# EAGLE design VFD-IV-26-T3-5x7 (EAGLE 7.2.0)
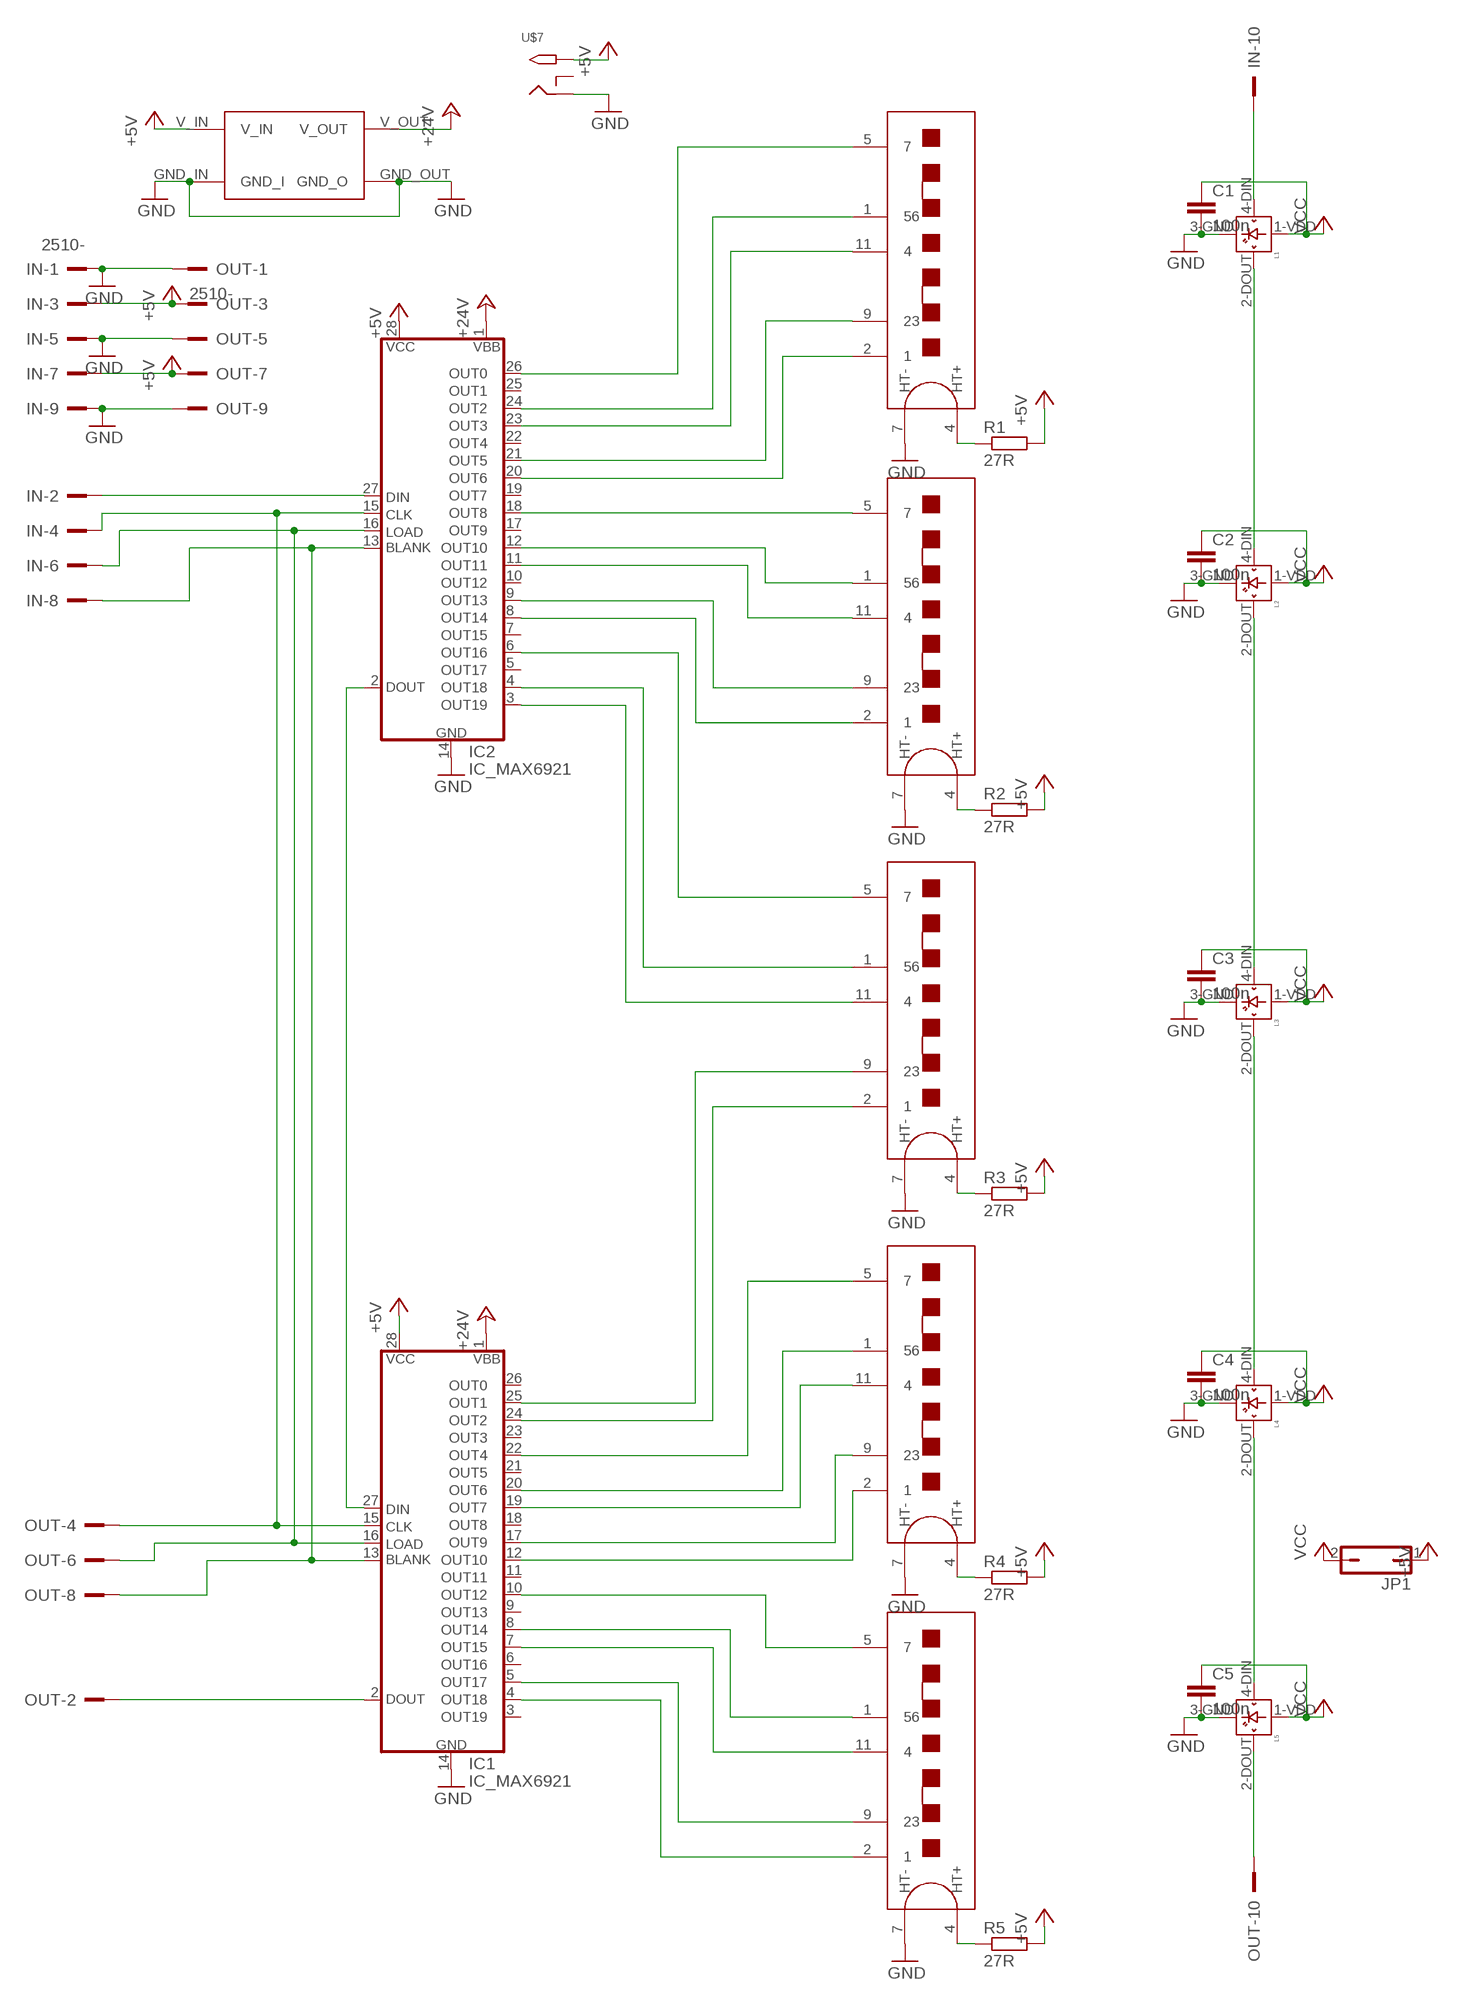
[diagram p0: schematic, sheet 1]

## Parts
1  IV-26-T3_DISP  [IV-26_T2_T3]
2  IV-26-T3_DISP  [IV-26_T2_T3]
3  IV-26-T3_DISP  [IV-26_T2_T3]
4  IV-26-T3_DISP  [IV-26_T2_T3]
5  IV-26-T3_DISP  [IV-26_T2_T3]
C1  100n  C-EU050-025X075  [C050-025X075]
C2  100n  C-EU050-025X075  [C050-025X075]
C3  100n  C-EU050-025X075  [C050-025X075]
C4  100n  C-EU050-025X075  [C050-025X075]
C5  100n  C-EU050-025X075  [C050-025X075]
IC1  IC_MAX6921  [S28]
IC2  IC_MAX6921  [S28]
IN  2510-  [PAK100/2500-10]
JP1  JP1Q  [JP1]
L1  WS2812B  [WS2812B]
L2  WS2812B  [WS2812B]
L3  WS2812B  [WS2812B]
L4  WS2812B  [WS2812B]
L5  WS2812B  [WS2812B]
OUT  2510-  [PAK100/2500-10]
R1  27R  R-EU_0207/10  [0207/10]
R2  27R  R-EU_0207/10  [0207/10]
R3  27R  R-EU_0207/10  [0207/10]
R4  27R  R-EU_0207/10  [0207/10]
R5  27R  R-EU_0207/10  [0207/10]
U$6  STEP_UP_MODULE  [STEP_UP_MODULE]
U$7  2.1MMJACKTHM  [PJ-102A]

## Nets
+5V [power]: IC1.28(VCC) IC2.28(VCC) IN.3 IN.7 JP1.1 OUT.3 OUT.7 R1.2 R2.2 R3.2 R4.2 R5.2 U$6.V_IN U$7.TIP
+24V [lo_power]: IC1.1(VBB) IC2.1(VBB) U$6.V_OUT
GND [power]: 1.7(HT-) 2.7(HT-) 3.7(HT-) 4.7(HT-) 5.7(HT-) C1.2 C2.2 C3.2 C4.2 C5.2 IC1.14(GND) IC2.14(GND) IN.1 IN.5 IN.9 L1.3-GND(GND) L2.3-GND(GND) L3.3-GND(GND) L4.3-GND(GND) L5.3-GND(GND) OUT.1 OUT.5 OUT.9 U$6.GND_IN(GND_I) U$6.GND_OUT(GND_O) U$7.RING
N$1: 1.5 IC2.26(OUT0)
N$3: 1.1 IC2.24(OUT2)
N$4: 1.11 IC2.23(OUT3)
N$6: 1.9 IC2.21(OUT5)
N$7: 1.2 IC2.20(OUT6)
N$8: 2.5 IC2.18(OUT8)
N$10: 2.1 IC2.12(OUT10)
N$11: 2.11 IC2.11(OUT11)
N$13: 2.9 IC2.9(OUT13)
N$14: 2.2 IC2.8(OUT14)
N$15: 3.5 IC2.6(OUT16)
N$17: 3.1 IC2.4(OUT18)
N$18: 3.11 IC2.3(OUT19)
N$20: 3.9 IC1.25(OUT1)
N$21: 3.2 IC1.24(OUT2)
N$22: 4.5 IC1.22(OUT4)
N$24: 4.1 IC1.20(OUT6)
N$25: 4.11 IC1.19(OUT7)
N$27: 4.9 IC1.17(OUT9)
N$28: 4.2 IC1.12(OUT10)
N$29: 5.5 IC1.10(OUT12)
N$31: 5.1 IC1.8(OUT14)
N$32: 5.11 IC1.7(OUT15)
N$34: 5.9 IC1.5(OUT17)
N$35: 5.2 IC1.4(OUT18)
N$36: L1.2-DOUT(DOUT) L2.4-DIN(DIN)
N$37: L2.2-DOUT(DOUT) L3.4-DIN(DIN)
N$38: L3.2-DOUT(DOUT) L4.4-DIN(DIN)
N$39: L4.2-DOUT(DOUT) L5.4-DIN(DIN)
N$40: IC1.15(CLK) IC2.15(CLK) IN.4 OUT.4
N$41: IC1.27(DIN) IC2.2(DOUT)
N$42: IC1.13(BLANK) IC2.13(BLANK) IN.8 OUT.8
N$43: IC1.16(LOAD) IC2.16(LOAD) IN.6 OUT.6
N$44: IC2.27(DIN) IN.2
N$45: IN.10 L1.4-DIN(DIN)
N$47 [lo_power]: 2.4(HT+) R2.1
N$48 [lo_power]: 3.4(HT+) R3.1
N$49 [lo_power]: 4.4(HT+) R4.1
N$50 [lo_power]: 5.4(HT+) R5.1
N$51 [lo_power]: 1.4(HT+) R1.1
N$53: IC1.2(DOUT) OUT.2
N$56: L5.2-DOUT(DOUT) OUT.10
VCC [lo_power]: C1.1 C2.1 C3.1 C4.1 C5.1 JP1.2 L1.1-VDD(VDD) L2.1-VDD(VDD) L3.1-VDD(VDD) L4.1-VDD(VDD) L5.1-VDD(VDD)
Unconnected: IC1.3(OUT19) IC1.6(OUT16) IC1.9(OUT13) IC1.11(OUT11) IC1.18(OUT8) IC1.21(OUT5) IC1.23(OUT3) IC1.26(OUT0) IC2.5(OUT17) IC2.7(OUT15) IC2.10(OUT12) IC2.17(OUT9) IC2.19(OUT7) IC2.22(OUT4) IC2.25(OUT1) U$7.RING_SW

## Library data of the parts
1-5 = vfd:IV-26-T3_DISP
C1-C5 = resistor:C-EU: CAPACITOR, European symbol
IC1 IC2 = rob:IC_MAX6921: 20-outputs, 76V, serial VFD driver Dangerousprototypes.com
IN OUT = con-3m:2510-: 3M (TM) Pak 100 4-Wall Header Source: 3M; MF: 3M; MPN: 2510-6002UB; OC_FARNELL: 9838244; OC_NEWARK: 46F4725
JP1 = jumper:JP1Q: JUMPER
L1-L5 = adafruit:WS2812B
R1-R5 = resistor:R-EU_: RESISTOR, European symbol
U$6 = vfd:STEP_UP_MODULE
U$7 = adafruit:2.1MMJACK: 2.1mm x 5.5mm THM DC jack with internal switch. Digikey part #PJ-102A, 4UCON part #05537 2.1mm x 5.5mm SMT DC jack with internal switch. Digikey part #PJ-002A-SMT, 4UCON part #03267 By microbuilder.eu & adafruit.com

## Net classes
1 lo_power: width 0.5 mm
2 power: width 1 mm

## Board
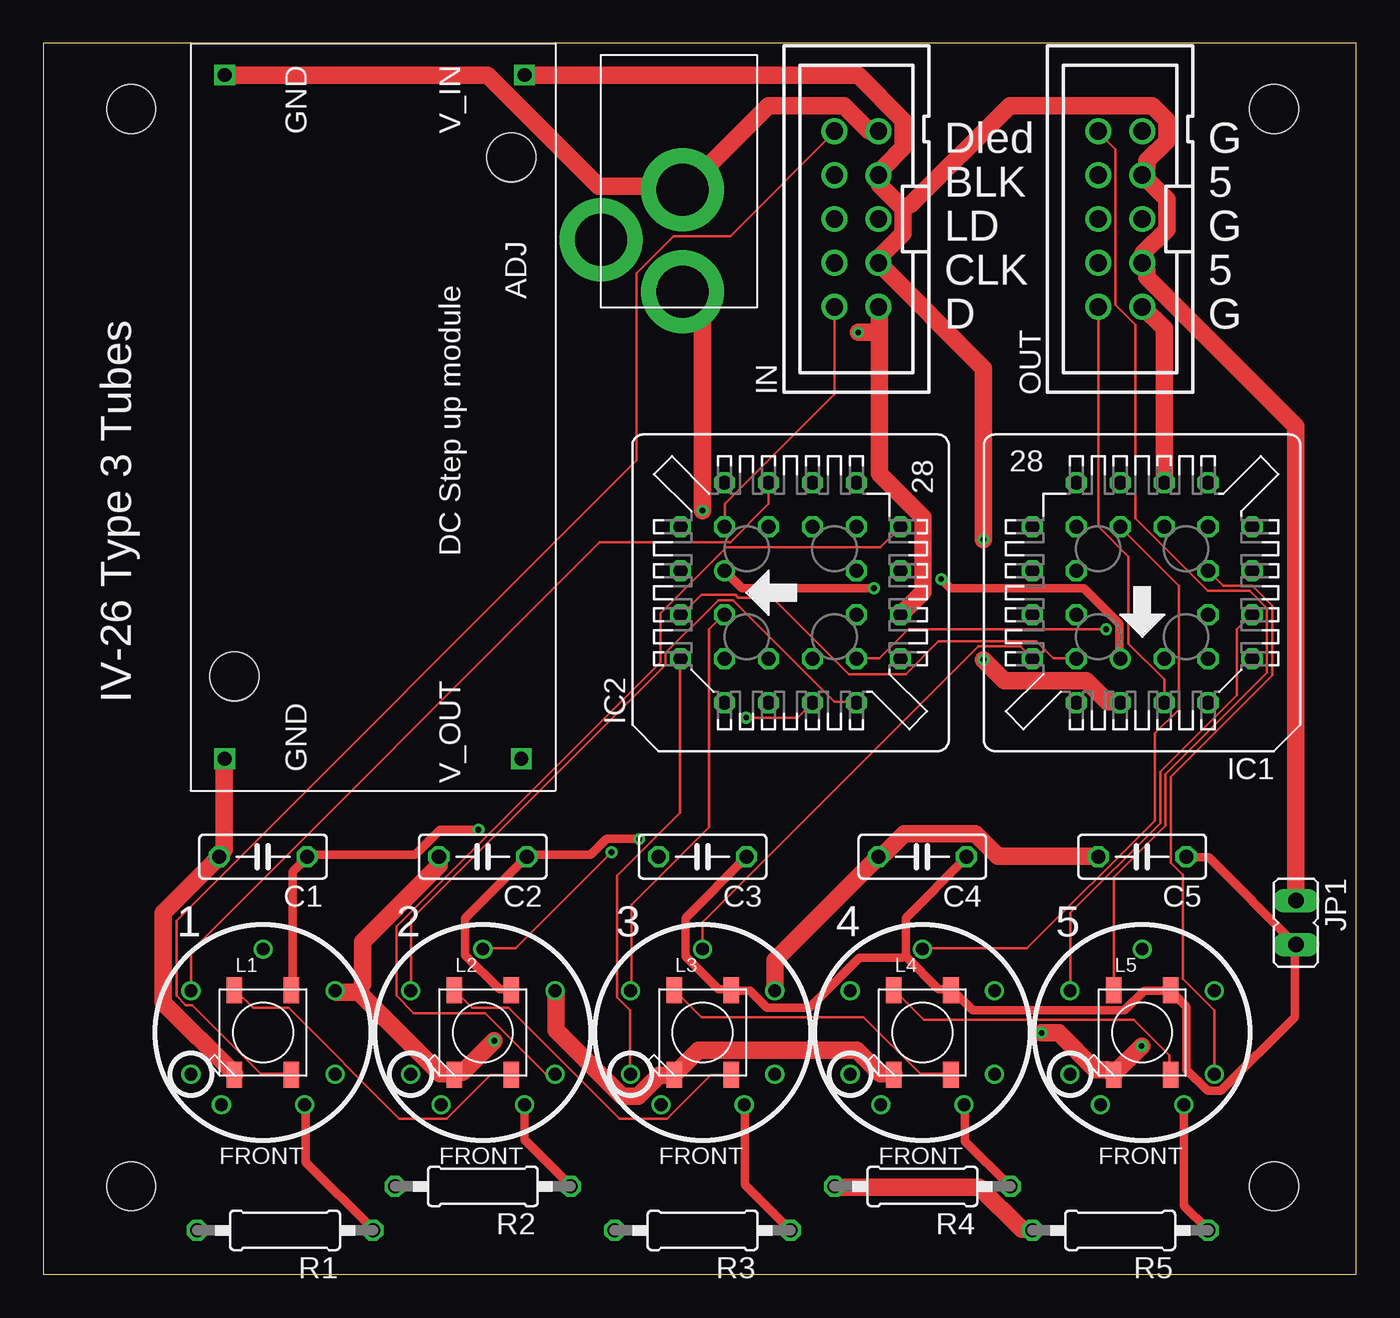
[diagram p1: board, top side]
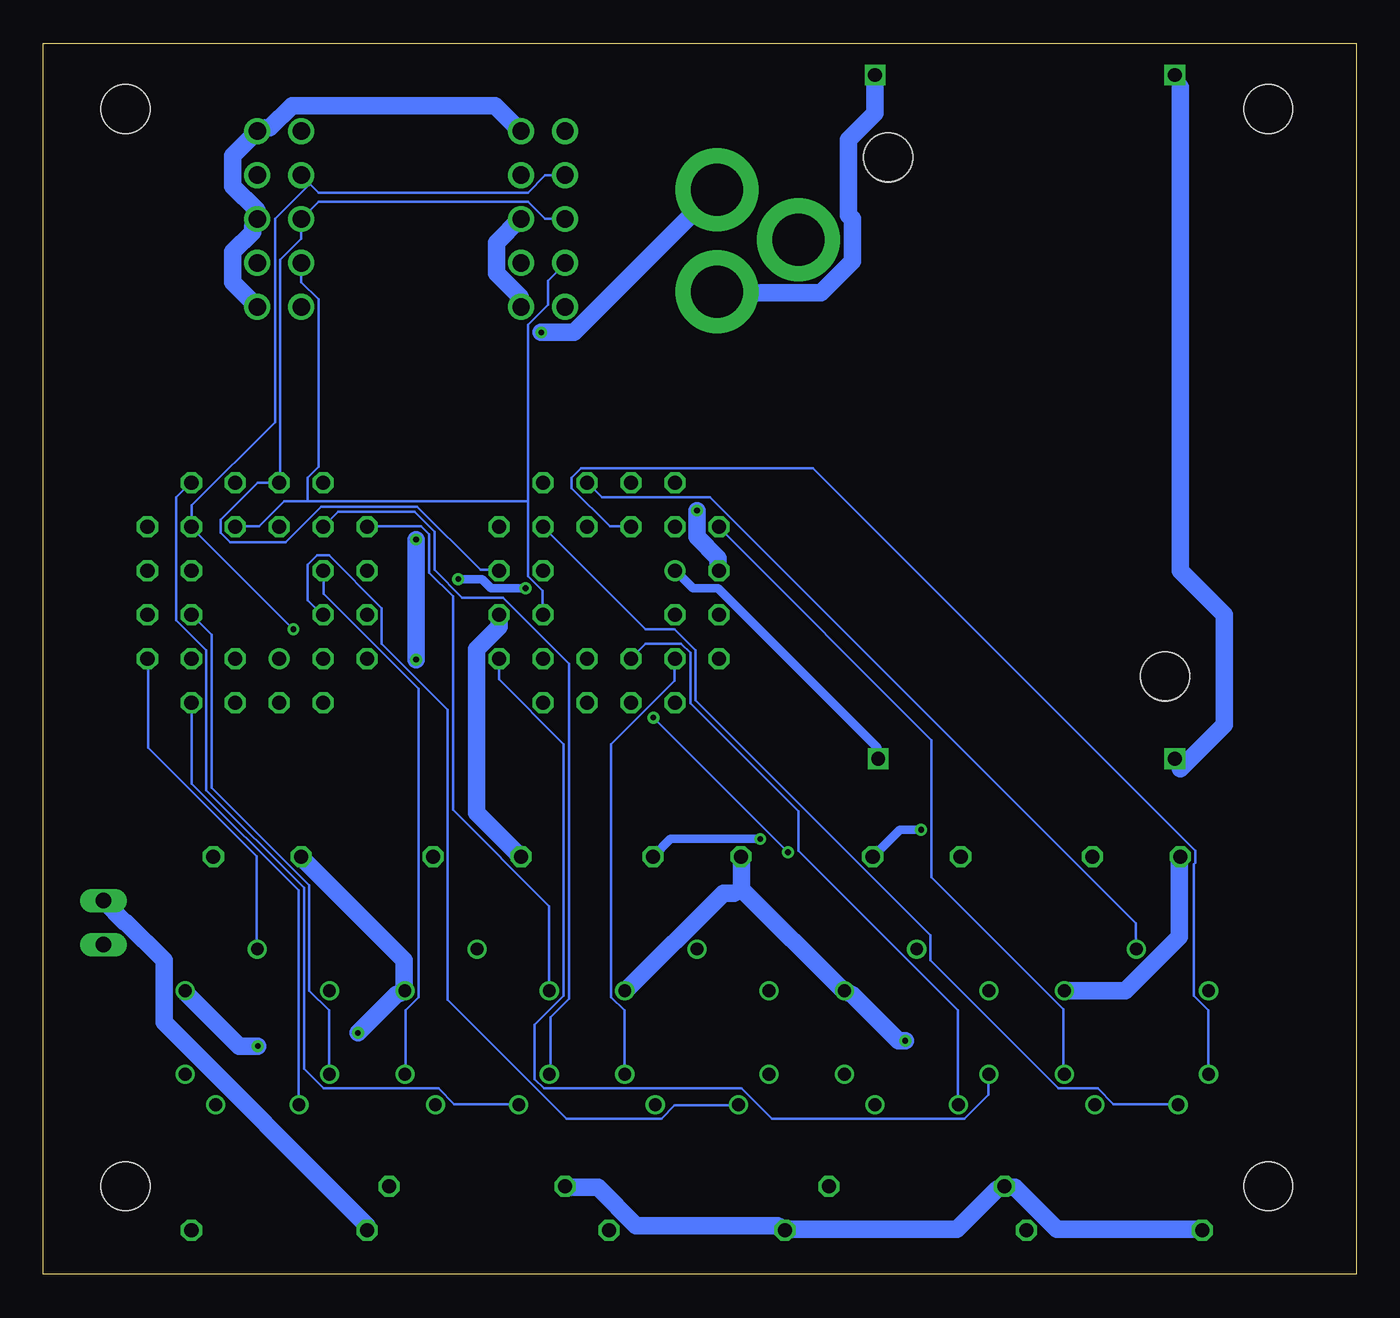
[diagram p2: board, bottom side, seen from below]

Size 75.87 x 71.11 mm. Coordinates in mm from the lower left corner, seen from the top.
Outline: 0,0 75.87,0 75.87,71.11 0,71.11 0,0
Copper layers (1*16): Top 0.0356mm / dielectric 1.5011mm / Bottom 0.0356mm
Design rules "oshpark-2layer": minimum track width 6mil, minimum drill 13mil, track to track 6mil, track to pad 6mil, pad to pad 6mil, via to via 6mil, smd to smd 6mil, copper to edge 15mil, drill to drill 6mil, minimum pad ring 7mil, minimum via ring 7mil, stop-mask expansion 4mil, vias tented up to drill 0mil, thermal gap 10mil
Holes 2.8 mm at 5.08,5.08 71.12,5.08 71.12,67.31 5.08,67.31 11.05,34.53 27.05,64.53

### Footprints (pad centres in the part's own frame; a part is rotated, then mirrored left to right if it is on the bottom)
IV-26_T2_T3 = drill 0.735: 1 -4.169,-2.407; 2 -2.407,-4.169; 4 2.407,-4.169; 5 4.169,-2.407; 7 4.169,2.407; 9 0,4.814; 11 -4.169,2.407
C050-025X075 = drill 0.813 octagon: 1 -2.54,0; 2 2.54,0
S28 = drill 0.813: 1 1.27,3.81 | drill 0.813 octagon: 2 -1.27,6.35; 3 -1.27,3.81; 4 -3.81,6.35; 5 -6.35,3.81; 6 -3.81,3.81; 7 -6.35,1.27; 8 -3.81,1.27; 9 -6.35,-1.27; 10 -3.81,-1.27; 11 -6.35,-3.81; 12 -3.81,-6.35; 13 -3.81,-3.81; 14 -1.27,-6.35; 15 -1.27,-3.81; 16 1.27,-6.35; 17 1.27,-3.81; 18 3.81,-6.35; 19 6.35,-3.81; 20 3.81,-3.81; 21 6.35,-1.27; 22 3.81,-1.27; 23 6.35,1.27; 24 3.81,1.27; 25 6.35,3.81; 26 3.81,6.35; 27 3.81,3.81; 28 1.27,6.35
PAK100/2500-10 = drill 1 pad 1.422: 1 -5.08,-1.27; 2 -5.08,1.27; 3 -2.54,-1.27; 4 -2.54,1.27; 5 0,-1.27; 6 0,1.27; 7 2.54,-1.27; 8 2.54,1.27; 9 5.08,-1.27; 10 5.08,1.27
JP1 = drill 0.914 long: 1 0,-1.27; 2 0,1.27
WS2812B = smd 1.5 x 0.9: 1-VDD 2.45,-1.65; 2-DOUT 2.45,1.65; 3-GND -2.45,1.65; 4-DIN -2.45,-1.65
0207/10 = drill 0.813 octagon: 1 -5.08,0; 2 5.08,0
STEP_UP_MODULE = drill 0.8 square: GND_IN -19.749,-8.573; GND_OUT 19.749,-8.573; V_IN -19.749,8.753; V_OUT 19.749,8.573 | hole 2.8: -14.986,8.001; 14.986,-8.001
PJ-102A = drill 3 pad 4.8: RING 0.1,-3.39; RING_SW -4.6,-6.29; TIP 0.1,-9.29

### Placement (x,y rotation side)
1  12.7,13.97 0 top
2  25.4,13.97 0 top
3  38.1,13.97 0 top
4  50.8,13.97 0 top
5  63.5,13.97 0 top
C1  12.7,24.13 180 top
C2  25.4,24.13 180 top
C3  38.1,24.13 180 top
C4  50.8,24.13 180 top
C5  63.5,24.13 180 top
IC1  63.5,39.37 180 top
IC2  43.18,39.37 90 top
IN  46.99,60.96 90 top
JP1  72.39,20.32 180 top
L1  12.7,13.97 90 top
L2  25.4,13.97 90 top
L3  38.1,13.97 90 top
L4  50.8,13.97 90 top
L5  63.5,13.97 90 top
OUT  62.23,60.96 90 top
R1  13.97,2.54 180 top
R2  25.4,5.08 180 top
R3  38.1,2.54 180 top
R4  50.8,5.08 180 top
R5  62.23,2.54 180 top
U$6  19.05,49.53 270 top
U$7  36.83,66.04 0 top

### Tracks (layer width: path | path; a pad name or v marks a point on that pad's centre or on a via)
+5V  (via drill 0.33)
  Top 1: v38.1,44.12 38.1,55.55 36.96,56.69 U$7.TIP | v54.33,35.51 55.55,34.29 60.27,34.29 61.49,33.07 62.18,33.07 IC1.28 | v54.33,42.44 54.33,52.35 IN.3 48.46,58.9 49.68,60.12 49.68,61.57 | 49.68,61.57 48.31,62.94 48.31,63.48 IN.7 48.54,63.93 49.68,65.08 49.68,66.67 47.09,69.27 27.81,69.27 U$6.V_IN | 49.68,61.57 50.14,61.8 55.85,67.51 64.08,67.51 64.92,66.67 64.92,65.46 63.78,64.31 63.78,63.93 OUT.7 63.55,63.48 64.92,62.1 64.92,60.35 63.55,58.98 63.55,58.45 OUT.3 63.78,57.99 63.78,57.61 72.39,49 JP1.1 | R4.2 45.72,5.03 54.1,5.03 56.54,2.59 57.15,2.59 R5.2
  Bottom 1: U$6.V_IN 27.81,69.27 27.81,67.06 29.34,65.53 29.34,61.19 29.11,60.96 29.11,58.52 30.94,56.69 36.88,56.69 U$7.TIP | v38.1,44.12 38.1,42.6 36.88,41.38 36.88,40.69 IC2.28 | v54.33,42.44 v54.33,35.51 | R1.2 8.91,2.59 17.3,2.59 19.74,5.03 20.27,5.03 R2.2 20.8,4.88 23.09,2.59 32.99,2.59 R3.2 33.45,2.82 41.6,2.82 43.81,5.03 45.72,5.03 R4.2 | R5.2 57.15,2.82 68.89,14.55 68.89,18.14 71.09,20.34 71.17,20.34 72.39,21.57 JP1.1
+24V  (via drill 0.33)
  Top 0.5: v51.89,40.16 52.43,39.62 60.12,39.62 62.18,37.57 62.18,35.59 IC1.1 | v48.01,39.62 40.39,39.62 IC2.1
  Bottom 0.5: U$6.V_OUT 27.66,29.79 27.66,30.4 36.88,39.62 38.33,39.62 39.32,40.62 IC2.1 | v51.89,40.16 50.52,40.16 49.99,39.62 v48.01,39.62
GND  (via drill 0.33)
  Top 1: IC1.14 64.77,54.63 63.55,55.85 OUT.1 | U$6.GND_IN 10.52,69.27 25.68,69.27 32.08,62.87 36.73,62.87 36.88,62.71 U$7.RING 37.34,62.94 41.91,67.51 46.25,67.51 47.7,66.06 48.23,66.06 IN.9 | 18.21,16.31 22.94,11.58 23.7,11.58 L2.3-GND 24.23,11.66 v26.06,13.49 | 18.21,16.31 16.92,16.31 1.7 | C2.2 22.86,23.62 18.44,19.2 18.44,16.76 18.21,16.31 | L1.3-GND 11.05,11.58 6.93,15.7 6.93,20.88 10.13,24.08 C1.2 10.44,24.54 10.44,29.72 U$6.GND_OUT | 2.7 29.64,16.31 29.64,14.1 33.45,10.29 34.37,10.29 35.59,11.51 36.42,11.51 L3.3-GND 36.8,11.89 37.87,12.95 47.02,12.95 48.39,11.58 49.15,11.58 L4.3-GND | v63.48,13.18 61.87,11.58 L5.3-GND 61.42,11.81 60.81,11.81 58.67,13.95 v57.68,13.95 | 3.7 42.29,16.38 42.29,18.14 48.23,24.08 C4.2 48.69,24.38 49.76,25.45 53.87,25.45 55.17,24.16 60.96,24.16 C5.2 | 48.31,54.41 48.31,46.25 50.83,43.74 50.83,39.4 IC2.14 | 48.31,54.41 48.31,55.85 IN.1 | 48.31,54.41 v47.09,54.41
  Bottom 1: OUT.1 64.92,57.3 64.92,59.05 63.78,60.2 63.78,60.5 OUT.5 63.55,60.96 63.55,61.49 64.92,62.87 64.92,64.62 OUT.9 63.02,66.22 62.79,66.22 61.49,67.51 49.76,67.51 48.31,66.06 IN.9 | 1.7 16.84,16.38 13.34,16.38 10.21,19.51 10.21,24.08 C1.2 | 35.51,22.25 35.51,24.08 C3.2 | 35.51,22.25 29.64,16.38 2.7 29.11,16.15 26.44,13.49 v26.06,13.49 | v63.48,13.18 64.54,13.18 67.67,16.31 5.7 | C5.2 60.96,24.08 55.02,18.14 55.02,16.38 4.7 55.47,16.15 v57.68,13.95 | IN.1 48.31,55.93 48.31,56.46 49.68,57.84 49.68,59.59 48.31,60.96 IN.5 | IC2.14 49.53,37.41 50.83,36.12 50.83,26.67 48.31,24.16 C4.2 | 35.51,22.25 35.97,22.02 36.58,22.02 42.22,16.38 3.7 | v47.09,54.41 45.19,54.41 36.96,62.64 U$7.RING
N$1
  Bottom 0.152: 1.5 16.92,11.58 16.92,15.32 24.54,22.94 24.54,30.86 36.8,43.13 IC2.26
N$2
  Bottom 1.016: 10.16,68.58 10.16,40.64 7.62,38.1 7.62,31.75 10.16,29.21
N$3
  Bottom 0.152: 1.1 8.53,11.58 8.53,15.24 9.37,16.08 9.37,23.7 9.3,23.77 9.3,24.46 31.39,46.56 44.81,46.56 45.34,46.02 45.34,45.41 43.13,43.2 41.91,43.2 IC2.24
N$4
  Top 0.152: IC2.23 41.91,44.5 39.7,42.29 32.16,42.29 8.53,18.67 1.11
N$6
  Bottom 0.152: 1.9 12.72,18.82 12.72,20.27 37.34,44.88 43.59,44.88 44.42,45.72 IC2.21
N$7
  Bottom 0.152: IC2.20 41.07,37.26 39.4,37.26 38.18,36.04 38.18,33.15 24.61,19.58 24.61,18.14 17.22,10.74 14.94,10.74 14.02,9.83 10.36,9.83 1.2
N$8
  Top 0.152: 2.5 29.57,11.58 29.03,11.58 25.53,15.09 21.41,15.09 20.42,16.08 20.42,20.12 35.66,35.36 35.66,38.18 39.47,41.99 48.39,41.99 49.53,43.13 IC2.18
N$10
  Bottom 0.152: IC2.12 49.53,34.37 45.8,30.63 45.8,16.08 47.47,14.4 47.47,11.28 46.94,10.74 35.51,10.74 33.76,8.99 22.63,8.99 21.26,10.36 21.26,11.51 2.1
N$11
  Top 0.152: 2.11 21.26,16.38 21.26,20.5 35.97,35.2 35.97,35.89 39.01,38.94 39.85,38.94 45.72,33.07 46.94,33.07 IC2.11
N$13  (via drill 0.33)
  Top 0.152: v32.84,24.38 27.28,18.82 25.45,18.82 2.9 | v40.62,32.16 43.59,32.16 IC2.9
  Bottom 0.152: v40.62,32.16 v32.84,24.38
N$14
  Bottom 0.152: 2.2 23.01,9.83 23.01,15.24 32.23,24.46 32.23,26.75 38.48,32.99 38.48,35.89 39.01,36.42 41.07,36.42 41.91,35.59 IC2.8
N$15
  Bottom 0.152: 3.5 42.29,11.58 42.29,15.24 43.05,16 43.05,30.63 39.4,34.29 39.4,35.51 IC2.6
N$17
  Top 0.152: 3.1 33.91,11.58 33.91,15.24 33.15,16 33.15,23.01 36.8,26.67 36.8,35.51 IC2.4
N$18
  Top 0.152: 3.11 33.98,16.38 33.98,21.34 38.48,25.83 38.48,37.26 39.32,38.1 IC2.3
N$20
  Top 0.152: 3.9 38.1,20.34 54.03,36.27 56.46,36.27 57.15,35.59 IC1.25
N$21
  Bottom 0.152: 3.2 35.74,9.75 39.4,9.75 40.16,8.99 45.64,8.99 52.5,15.85 52.5,32.61 56.31,36.42 56.31,38.48 59.36,41.53 60.05,41.53 60.58,41 60.58,38.94 59.74,38.1 IC1.24
N$22
  Bottom 0.152: 4.5 54.94,11.58 54.94,15.24 54.18,16 54.18,33.83 59.66,39.32 59.66,40.62 IC1.22
N$24
  Bottom 0.152: IC1.20 58.83,44.04 54.41,44.04 53.26,42.9 53.26,40.69 51.66,39.09 49.3,39.09 45.49,35.28 45.49,15.93 46.56,14.86 46.56,11.58 4.1
N$25
  Bottom 0.152: 4.11 46.63,21.26 52.2,26.82 52.2,39.17 53.57,40.54 53.57,42.75 54.03,43.2 57.15,43.2 IC1.19
N$27
  Top 0.152: 4.9 50.83,18.82 56.84,18.82 64.24,26.21 64.24,31.24 65.61,32.61 65.61,39.78 62.26,43.13 IC1.17
N$28
  Bottom 0.152: 4.2 48.46,9.83 52.12,9.83 53.03,10.74 59.66,10.74 60.81,11.89 60.81,22.33 66.45,27.96 66.45,36.04 68.2,37.8 68.2,44.88 67.36,45.72 IC1.12
N$29
  Top 0.152: 5.5 67.67,11.58 67.67,15.24 65.84,17.07 65.84,23.09 65.15,23.77 65.15,28.73 71.02,34.59 71.02,38.63 69.88,39.78 68.2,39.78 67.36,40.62 IC1.10
N$31
  Bottom 0.152: 5.1 59.36,11.58 59.36,15.24 60.5,16.38 60.5,22.48 66.14,28.12 66.14,36.96 67.28,38.1 IC1.8
N$32
  Top 0.152: 5.11 59.36,16.38 59.36,20.88 64.54,26.06 64.54,29.03 68.96,33.45 68.96,37.26 69.8,38.1 IC1.7
N$34
  Bottom 0.152: 5.9 63.55,18.82 63.55,24.16 69.8,30.4 69.8,35.51 IC1.5
N$35
  Bottom 0.152: 5.2 61.11,9.83 61.11,22.17 67.28,28.35 67.28,32.99 IC1.4
N$36
  Top 0.152: L2.4-DIN 26.98,11.51 25.83,11.51 23.32,8.99 20.57,8.99 14.17,15.39 12.12,15.39 11.12,16.38 L1.2-DOUT
N$37
  Top 0.152: L3.4-DIN 39.7,11.51 38.56,11.51 36.04,8.99 33.3,8.99 26.9,15.39 24.77,15.39 23.77,16.38 L2.2-DOUT
N$38
  Top 0.152: L4.4-DIN 52.43,11.58 50.67,11.58 47.4,14.86 38.02,14.86 36.5,16.38 L3.2-DOUT
N$39
  Top 0.152: L5.4-DIN 65.08,11.58 65.08,12.65 63.02,14.71 50.9,14.71 49.23,16.38 L4.2-DOUT
N$40
  Bottom 0.152: 47.85,44.65 47.85,54.86 46.71,56.01 46.71,57.38 45.72,58.37 IN.4 | 47.85,44.65 47.85,40.31 47.02,39.47 47.02,38.1 IC2.15 | 47.85,44.65 60.58,44.65 | 60.58,44.65 61.95,44.65 63.4,43.2 64.77,43.2 IC1.15 | OUT.4 60.96,57.3 59.97,56.31 59.97,46.63 60.58,46.02 60.58,44.65
N$41
  Top 0.152: IC1.27 59.66,35.59 58.37,35.59 57.38,36.58 51.74,36.58 49.84,34.67 46.56,34.67 42.14,39.09 40.16,39.09 40.01,39.24 38.02,39.24 36.88,38.1 IC2.2
N$42  (via drill 0.33)
  Top 0.152: v61.42,37.26 49.99,37.26 48.31,35.59 47.02,35.59 IC2.13
  Bottom 0.152: IN.8 45.72,63.48 46.86,63.48 47.85,62.48 59.97,62.48 60.96,63.48 OUT.8 60.5,62.94 62.48,60.96 62.48,49.23 67.28,44.42 67.28,43.2 IC1.13 67.28,43.13 v61.42,37.26
N$43
  Bottom 0.152: IN.6 46.86,60.96 47.85,61.95 59.97,61.95 OUT.6 60.96,59.82 62.18,58.6 62.18,45.72 IC1.16 63.48,45.72 65.61,43.59 65.61,42.82 65.08,42.29 61.87,42.29 59.82,44.35 54.25,44.35 50.6,40.69 49.53,40.69 IC2.16
N$44
  Top 0.152: IN.2 45.72,50.83 39.4,44.5 39.4,43.2 IC2.27
N$45
  Top 0.152: L1.4-DIN 14.33,11.58 12.57,11.58 8.61,15.54 8.23,15.54 7.7,16.08 7.7,20.42 34.29,47.02 34.29,57.84 36.42,59.97 39.7,59.97 45.72,65.99 IN.10
N$47
  Top 0.5: 2.4 27.81,9.75 27.81,7.77 30.48,5.11 R2.1
N$48
  Top 0.5: R3.1 40.54,5.18 40.54,9.75 3.4
N$49
  Top 0.5: R4.1 53.26,7.7 53.26,9.75 4.4
N$50
  Top 0.5: 5.4 65.91,9.75 65.91,3.96 67.28,2.59 R5.1
N$51
  Top 0.5: 1.4 15.16,9.75 15.16,6.48 19.05,2.59 R1.1
N$53
  Top 0.152: IC1.2 64.77,34.37 62.71,36.42 62.71,41.45 60.96,43.2 OUT.2
N$56
  Top 0.152: L5.2-DOUT 61.87,16.46 61.87,22.94 64.85,25.91 64.85,28.88 70.71,34.75 70.71,38.48 69.72,39.47 67.28,39.47 63.09,43.66 63.09,54.86 61.95,56.01 61.95,65 60.96,65.99 OUT.10
VCC  (via drill 0.33)
  Top 0.5: L1.1-VDD 14.4,16.46 14.4,23.24 15.24,24.08 C1.1 15.47,24.23 21.49,24.23 22.94,25.68 v25.15,25.68 | L2.1-VDD 26.98,16.46 26.36,16.46 24.38,18.44 24.38,20.57 C2.1 28.12,24.23 31.62,24.23 32.54,25.15 v34.44,25.15 | C5.1 66.06,24.08 67.36,24.08 JP1.2 72.31,18.82 72.31,14.86 68.05,10.59 67.28,10.59 66.06,11.81 66.06,15.47 65.3,16.23 L5.1-VDD 65.08,16.38 63.63,16.38 62.48,15.24 53.72,15.24 52.65,16.31 L4.1-VDD 52.43,16.46 51.74,16.46 49.84,18.36 | C3.1 40.62,24.08 37.11,20.57 37.11,18.36 39.01,16.46 39.7,16.46 L3.1-VDD 40.01,16.38 40.84,16.38 41.83,15.39 44.27,15.39 47.17,18.29 49.61,18.29 49.84,18.36 | 49.84,18.36 49.84,20.57 53.34,24.08 C4.1
  Bottom 0.5: v25.15,25.68 26.36,25.68 27.89,24.16 C2.1 | v34.44,25.15 39.62,25.15 C3.1

### Text on the board
tPlace: Dled | G | BLK | 5 | LD | G | CLK | 5 | D | G | IV-26 Type 3 Tubes